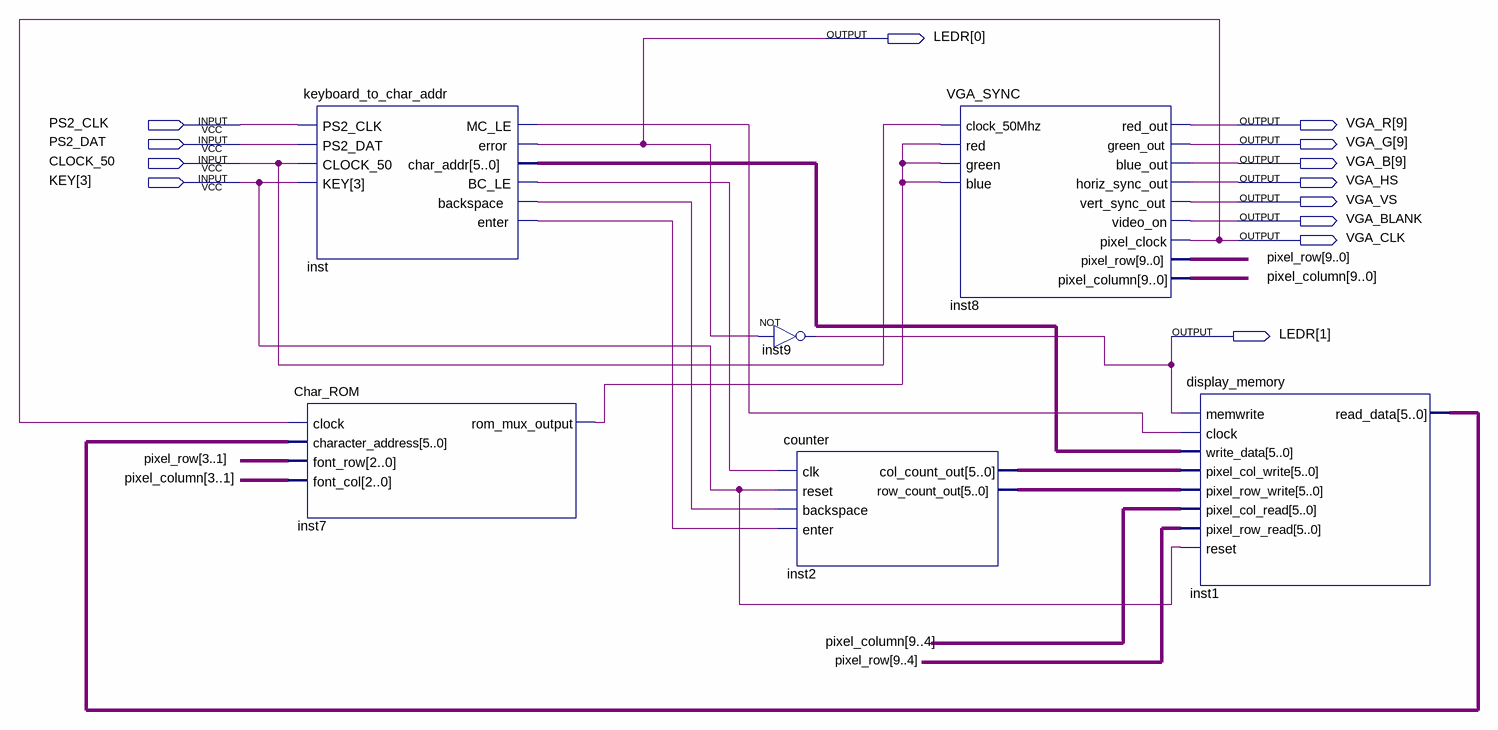
[diagram p0: schematic sheet]
// Quartus schematic text_editor.bdf as structural Verilog: 6 symbols, 13 pins
module text_editor (
  input  PS2_CLK,
  input  PS2_DAT,
  input  CLOCK_50,
  input  [3:3] KEY,
  output [1:0] LEDR,
  output [9:9] VGA_R,
  output [9:9] VGA_G,
  output [9:9] VGA_B,
  output VGA_HS,
  output VGA_VS,
  output VGA_BLANK,
  output VGA_CLK
);

  wire inst7_rom_mux_output, inst_backspace, inst_bc_le, inst_enter, inst_mc_le;
  wire [5:0] inst1_read_data, inst2_col_count_out, inst2_row_count_out, inst_char_addr;
  wire [9:0] pixel_column, pixel_row;

  keyboard_to_char_addr inst (
    .PS2_CLK(PS2_CLK), .PS2_DAT(PS2_DAT), .CLOCK_50(CLOCK_50), .KEY(KEY[3]), .MC_LE(inst_mc_le),
    .error(LEDR[0]), .char_addr(inst_char_addr), .BC_LE(inst_bc_le), .backspace(inst_backspace),
    .enter(inst_enter));
  Char_ROM inst7 (
    .clock(VGA_CLK), .character_address(inst1_read_data), .font_row(pixel_row[3:1]),
    .font_col(pixel_column[3:1]), .rom_mux_output(inst7_rom_mux_output));
  not inst9 (LEDR[1], LEDR[0]);
  counter inst2 (
    .clk(inst_bc_le), .reset(KEY[3]), .backspace(inst_backspace), .enter(inst_enter),
    .col_count_out(inst2_col_count_out), .row_count_out(inst2_row_count_out));
  VGA_SYNC inst8 (
    .clock_50Mhz(CLOCK_50), .red(inst7_rom_mux_output), .green(inst7_rom_mux_output),
    .blue(inst7_rom_mux_output), .red_out(VGA_R[9]), .green_out(VGA_G[9]), .blue_out(VGA_B[9]),
    .horiz_sync_out(VGA_HS), .vert_sync_out(VGA_VS), .video_on(VGA_BLANK), .pixel_clock(VGA_CLK),
    .pixel_row(pixel_row), .pixel_column(pixel_column));
  display_memory inst1 (
    .memwrite(LEDR[1]), .clock(inst_mc_le), .write_data(inst_char_addr),
    .pixel_col_write(inst2_col_count_out), .pixel_row_write(inst2_row_count_out),
    .pixel_col_read(pixel_column[9:4]), .pixel_row_read(pixel_row[9:4]), .reset(KEY[3]),
    .read_data(inst1_read_data));
endmodule
